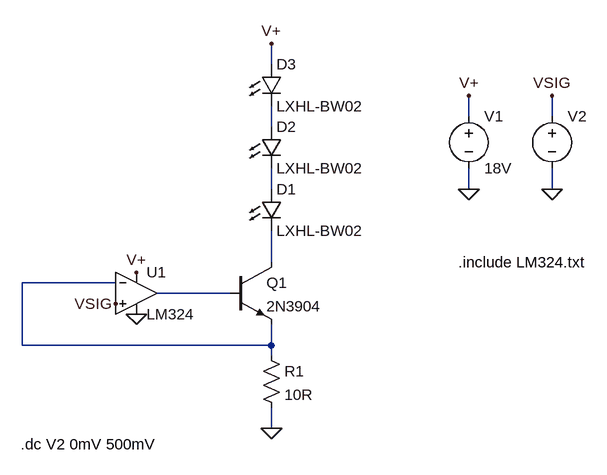
[diagram p0: schematic driver_option1.asc]
driver_option1.asc, the LTspice schematic file:
Version 4
SHEET 1 1136 680
WIRE 400 -320 400 -352
WIRE 704 -240 704 -272
WIRE 832 -240 832 -272
WIRE 400 -224 400 -256
WIRE 400 -128 400 -160
WIRE 704 -128 704 -160
WIRE 832 -128 832 -160
WIRE 400 -16 400 -64
WIRE 160 16 16 16
WIRE 336 32 224 32
WIRE 16 112 16 16
WIRE 400 112 400 80
WIRE 400 112 16 112
WIRE 400 128 400 112
WIRE 400 240 400 208
FLAG 704 -128 0
FLAG 704 -272 V+
FLAG 192 0 V+
FLAG 192 64 0
FLAG 832 -272 VSIG
FLAG 832 -128 0
FLAG 160 48 VSIG
FLAG 400 -352 V+
FLAG 400 240 0
SYMBOL Opamps\\opamp2 192 -32 R0
SYMATTR InstName U1
SYMATTR Value LM324
SYMBOL voltage 704 -256 R0
WINDOW 123 0 0 Left 2
WINDOW 39 0 0 Left 2
SYMATTR InstName V1
SYMATTR Value 18V
SYMBOL npn 336 -16 R0
SYMATTR InstName Q1
SYMATTR Value 2N3904
SYMBOL voltage 832 -256 R0
WINDOW 3 24 44 Left 2
WINDOW 123 0 0 Left 2
WINDOW 39 0 0 Left 2
SYMATTR InstName V2
SYMATTR Value ""
SYMBOL LED 384 -128 R0
SYMATTR InstName D1
SYMATTR Value LXHL-BW02
SYMBOL res 384 112 R0
SYMATTR InstName R1
SYMATTR Value 10R
SYMBOL LED 384 -224 R0
SYMATTR InstName D2
SYMATTR Value LXHL-BW02
SYMBOL LED 384 -320 R0
SYMATTR InstName D3
SYMATTR Value LXHL-BW02
TEXT 688 -16 Left 2 !.include LM324.txt
TEXT 14 264 Left 2 !.dc V2 0mV 500mV

The netlist it stands for:
* driver_option1.asc
XU1 VSIG N004 V+ 0 N005 LM324  ; pins In+ In- V+ V- OUT
V1 V+ 0 18V
Q1 N003 N005 N004 0 2N3904
V2 VSIG 0
D1 N002 N003 LXHL-BW02
R1 N004 0 10R
D2 N001 N002 LXHL-BW02
D3 V+ N001 LXHL-BW02
.model D D
.lib standard.dio
.model NPN NPN
.model PNP PNP
.lib standard.bjt
.include LM324.txt
.dc V2 0mV 500mV
.backanno
.end